# Altium schematic sheet Bank.SchDoc
size A4; DocumentNumber: 2; SheetNumber: 2; SheetTotal: 10
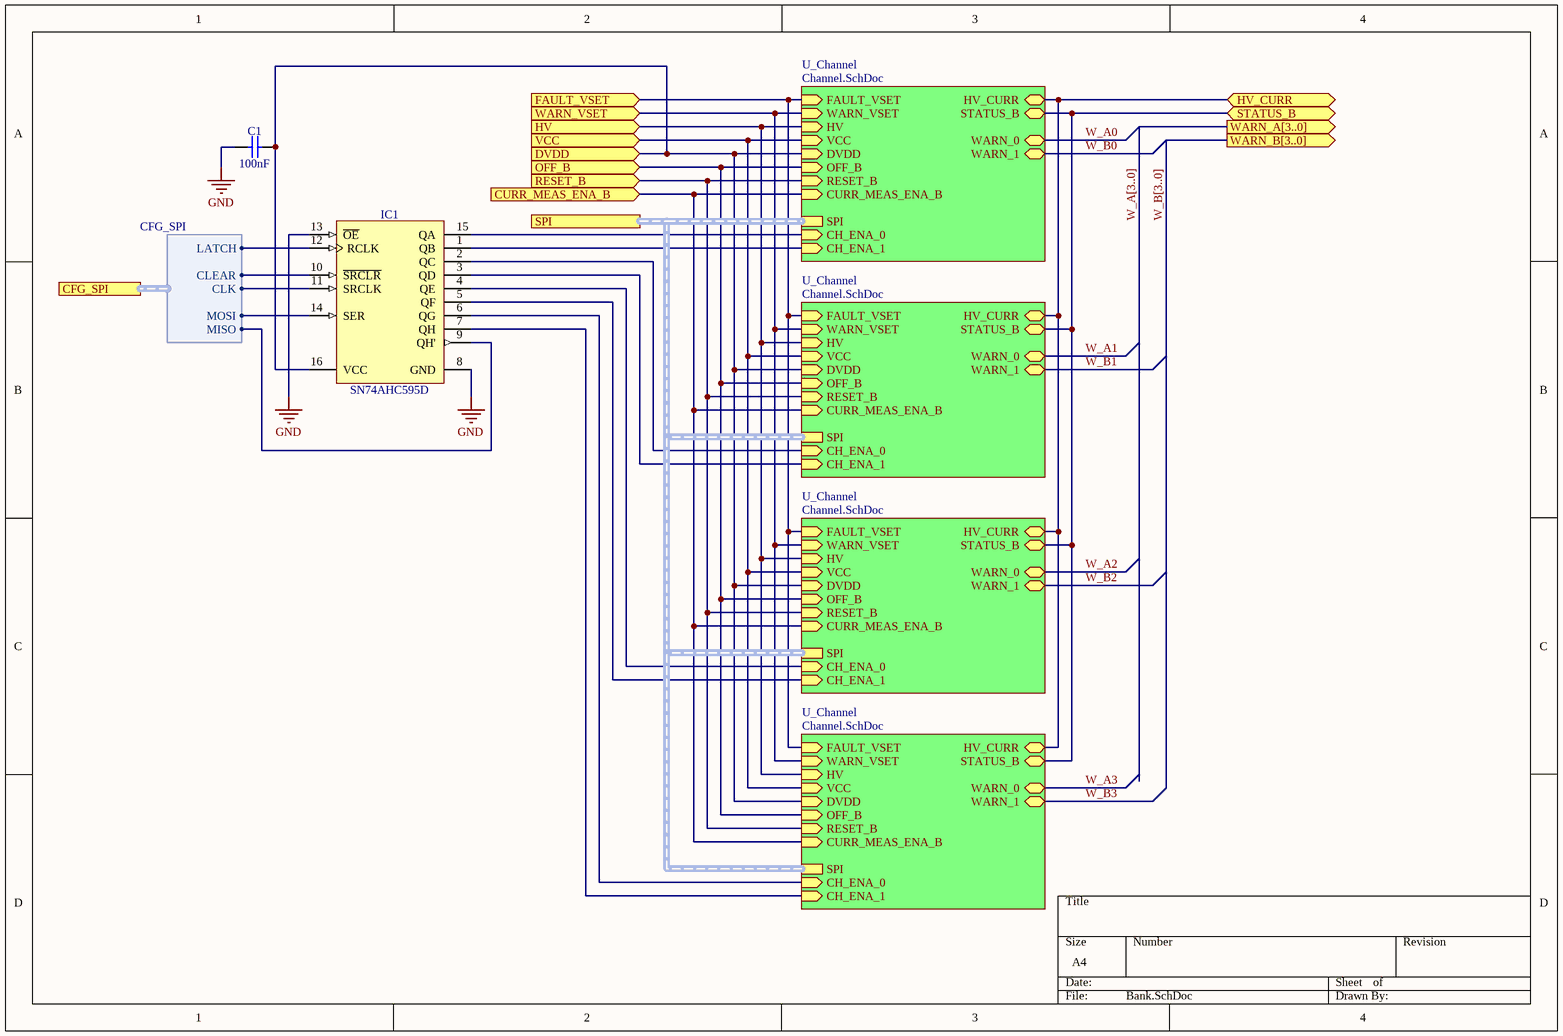
[diagram p0: Bank.SchDoc]

## Parts
C1  100nF  [CAPC2012X135N]
IC1  SN74AHC595D  [SOIC127P600X175-16N]

## Sub-sheets
U_Channel = Channel.SchDoc: FAULT_VSET (in), WARN_VSET (in), HV (in), DVDD (in), OFF_B (in), RESET_B (in), CURR_MEAS_ENA_B (in), CH_ENA_0 (in), SPI (harness SPI), CH_ENA_1 (in), WARN_0 (bidir), HV_CURR (bidir), VCC (in), STATUS_B (bidir), WARN_1 (bidir)
U_Channel = Channel.SchDoc: FAULT_VSET (in), WARN_VSET (in), HV (in), DVDD (in), OFF_B (in), RESET_B (in), CURR_MEAS_ENA_B (in), CH_ENA_0 (in), SPI (harness SPI), CH_ENA_1 (in), WARN_0 (bidir), HV_CURR (bidir), VCC (in), STATUS_B (bidir), WARN_1 (bidir)
U_Channel = Channel.SchDoc: FAULT_VSET (in), WARN_VSET (in), HV (in), DVDD (in), OFF_B (in), RESET_B (in), CURR_MEAS_ENA_B (in), CH_ENA_0 (in), SPI (harness SPI), CH_ENA_1 (in), WARN_0 (bidir), HV_CURR (bidir), VCC (in), STATUS_B (bidir), WARN_1 (bidir)
U_Channel = Channel.SchDoc: FAULT_VSET (in), WARN_VSET (in), HV (in), DVDD (in), OFF_B (in), RESET_B (in), CURR_MEAS_ENA_B (in), CH_ENA_0 (in), SPI (harness SPI), CH_ENA_1 (in), WARN_0 (bidir), HV_CURR (bidir), VCC (in), STATUS_B (bidir), WARN_1 (bidir)

## Ports
CFG_SPI (harness CFG_SPI), CURR_MEAS_ENA_B (in), DVDD (in), FAULT_VSET (in), HV (in), HV_CURR (bidir), OFF_B (in), RESET_B (in), SPI (harness SPI), STATUS_B (bidir), VCC (in), WARN_A[3..0] (out), WARN_B[3..0] (out), WARN_VSET (in)

## Harnesses
CFG_SPI: LATCH, CLK, MOSI, MISO, CLEAR

## Nets
GND: C1.1 IC1.8(GND) IC1.13(~{OE})
CURR_MEAS_ENA_B: port CURR_MEAS_ENA_B, sheet U_Channel/CURR_MEAS_ENA_B, sheet U_Channel/CURR_MEAS_ENA_B, sheet U_Channel/CURR_MEAS_ENA_B, sheet U_Channel/CURR_MEAS_ENA_B
DVDD: C1.2 IC1.16(VCC) ; port DVDD, sheet U_Channel/DVDD, sheet U_Channel/DVDD, sheet U_Channel/DVDD, sheet U_Channel/DVDD
FAULT_VSET: port FAULT_VSET, sheet U_Channel/FAULT_VSET, sheet U_Channel/FAULT_VSET, sheet U_Channel/FAULT_VSET, sheet U_Channel/FAULT_VSET
HV: port HV, sheet U_Channel/HV, sheet U_Channel/HV, sheet U_Channel/HV, sheet U_Channel/HV
HV_CURR: port HV_CURR, sheet U_Channel/HV_CURR, sheet U_Channel/HV_CURR, sheet U_Channel/HV_CURR, sheet U_Channel/HV_CURR
OFF_B: port OFF_B, sheet U_Channel/OFF_B, sheet U_Channel/OFF_B, sheet U_Channel/OFF_B, sheet U_Channel/OFF_B
RESET_B: port RESET_B, sheet U_Channel/RESET_B, sheet U_Channel/RESET_B, sheet U_Channel/RESET_B, sheet U_Channel/RESET_B
STATUS_B: port STATUS_B, sheet U_Channel/STATUS_B, sheet U_Channel/STATUS_B, sheet U_Channel/STATUS_B, sheet U_Channel/STATUS_B
VCC: port VCC, sheet U_Channel/VCC, sheet U_Channel/VCC, sheet U_Channel/VCC, sheet U_Channel/VCC
W_A0: sheet U_Channel/WARN_0
W_A1: sheet U_Channel/WARN_0
W_A2: sheet U_Channel/WARN_0
W_A3: sheet U_Channel/WARN_0
W_B0: sheet U_Channel/WARN_1
W_B1: sheet U_Channel/WARN_1
W_B2: sheet U_Channel/WARN_1
W_B3: sheet U_Channel/WARN_1
WARN_VSET: port WARN_VSET, sheet U_Channel/WARN_VSET, sheet U_Channel/WARN_VSET, sheet U_Channel/WARN_VSET, sheet U_Channel/WARN_VSET
NetIC1_1: IC1.1(QB) ; sheet U_Channel/CH_ENA_1
NetIC1_2: IC1.2(QC) ; sheet U_Channel/CH_ENA_0
NetIC1_3: IC1.3(QD) ; sheet U_Channel/CH_ENA_1
NetIC1_4: IC1.4(QE) ; sheet U_Channel/CH_ENA_0
NetIC1_5: IC1.5(QF) ; sheet U_Channel/CH_ENA_1
NetIC1_6: IC1.6(QG) ; sheet U_Channel/CH_ENA_0
NetIC1_7: IC1.7(QH) ; sheet U_Channel/CH_ENA_1
NetIC1_9: IC1.9(QH') ; port CFG_SPI.MISO
NetIC1_10: IC1.10(~{SRCLR}) ; port CFG_SPI.CLEAR
NetIC1_11: IC1.11(SRCLK) ; port CFG_SPI.CLK
NetIC1_12: IC1.12(RCLK) ; port CFG_SPI.LATCH
NetIC1_14: IC1.14(SER) ; port CFG_SPI.MOSI
NetIC1_15: IC1.15(QA) ; sheet U_Channel/CH_ENA_0

## Buses and harness runs
bus W_A[3..0] = port WARN_A[3..0]
bus W_B[3..0] = port WARN_B[3..0]
harness port SPI = sheet U_Channel/SPI

## Library data of the parts
C1 = CC0805_100NF_50V_10%_X7R: Non-polarised capacitor; Part Description: SMD Multilayer Chip Ceramic Capacitor; Manufacturer: GENERIC; Manufacturer1 Part Number: C2012X7R1H104K085AA; Voltage: 50V; TC: X7R; Tolerance: ±10%; Part Number: CC0805_100NF_50V_10%_X7R; Component Kind: Standard; Component Type: Standard; Pin Count: 2; Value: 100nF; Status: Preferred; Manufacturer Part Number: CC0805_100NF_50V_10%_X7R; Case: 0805; Mounted: Yes; Socket: No; SMD: Yes; Sense: No; Manufacturer1 Example: TDK; Manufacturer1 ComponentHeight: 1mm; HelpURL: \\cern.ch\dfs\Applications\Altium\Datasheets\CC0805_X7R_TDK_C.pdf; Author: CERN DEM JLC; CreateDate: 03.12.2007; LatestRevisionDate: 22.04.2015
IC1 = SN74AHC595D: 8-Bit Shift Register With 3-State Output Register; Part Description: 8-Bit Shift Register With 3-State Output Registers; Manufacturer: TEXAS INSTRUMENTS; PressFit: No; Bonding: No; Part Number: SN74AHC595D; Component Kind: Standard; Component Type: Standard; Device: SN74AHC595D; PackageDescription: SOIC 16, Pitch 1.27mm - Body 4x10mm, IPC Medium Density; Manufacturer Part Number: SN74AHC595D; Pin Count: 16; Case: SOIC16; Mounted: Yes; Socket: No; SMD: Yes; Sense: No; ComponentHeight: 1.75mm; Author: CERN DEM JLC; HelpURL: \\cern.ch\dfs\Applications\Altium\Datasheets\SN74AHC595D.pdf; CreateDate: 26.09.2013; LatestRevisionDate: 26.09.2013